# EAGLE design gateac11 (EAGLE 8.6.3)
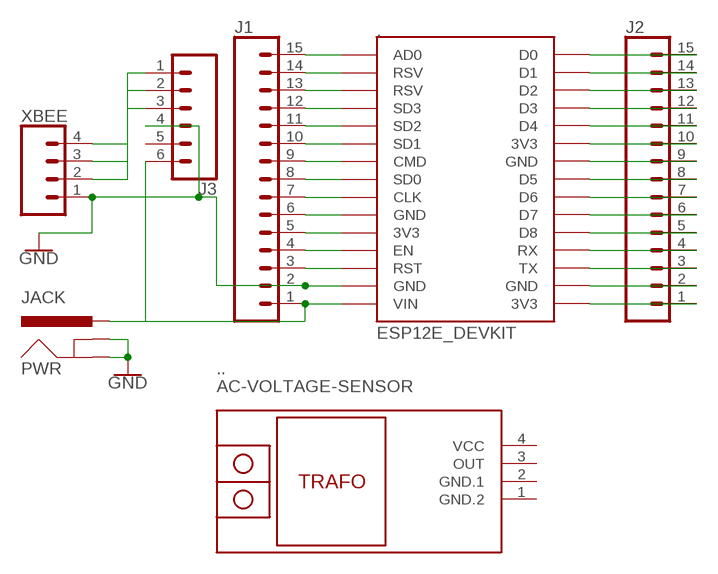
[diagram p0: schematic, sheet 1]

## Parts
.  ESP12E_DEVKIT  [ESP12E_DEVKIT]
..  AC-VOLTAGE-SENSOR  [AC-VOLTAGE-SENSOR]
J1  CONN_15  [1X15]
J2  CONN_15  [1X15]
J3  CONN_06SILK_FEMALE_PTH  [1X06]
PWR  JACK  POWER_JACKPTH_BREAD  [POWER_JACK_PTH_BREAD]
XBEE  CONN_04  [1X04]

## Nets
3V3: J3.1 XBEE.4
GND: ..GND@1(GND) J1.2 J3.4 PWR.GND PWR.GNDBREAK XBEE.1
N$1: ..AD0 J1.15
N$2: ..RSV@0(RSV) J1.14
N$3: ..RSV@1(RSV) J1.13
N$4: ..SD3 J1.12
N$5: ..SD2 J1.11
N$6: ..SD1 J1.10
N$7: ..CMD J1.9
N$8: ..SD0 J1.8
N$9: ..CLK J1.7
N$10: ..GND@0(GND) J1.6
N$11: ..3V3@0(3V3) J1.5
N$12: ..EN J1.4
N$13: ..RST J1.3
N$15: ..VIN J1.1 J3.6 PWR.PWR
N$16: ..D0 J2.15
N$17: ..D1 J2.14
N$18: ..D2 J2.13
N$19: ..D3 J2.12
N$20: ..D4 J2.11
N$21: ..3V3@1(3V3) J2.10
N$22: ..GND@2(GND) J2.9
N$23: ..D5 J2.8
N$24: ..D6 J2.7
N$25: ..D7 J2.6
N$26: ..D8 J2.5
N$27: ..RX J2.4
N$28: ..TX J2.3
N$29: ..GND@3(GND) J2.2
N$30: ..3V3@2(3V3) J2.1
RX: J3.3 XBEE.2
TX: J3.2 XBEE.3
Unconnected: ...3(OUT) J3.5

## Power pins joined to a net without a drawn wire
GND.1: ...2(GND.1)
GND.2: ...1(GND.2)
VCC: ...4(VCC)

## Library data of the parts
. = ESP12E_DEVKIT:ESP12E_DEVKIT: ESP12E DEVKIT BOARD
.. = diy-modules:AC-VOLTAGE-SENSOR: Isolated AC Voltage Sensor based on ZMPT101B transformer ZMPT101B Voltage Transformer Operating Guide is available here: http://www.zeming-e.com/file/0_2013_10_18_093344.pdf Click here to find device on ebay.com <http://www.ebay.com/sch/arduino+voltage+transformer>
J1 J2 = SparkFun-Connectors:CONN_15: Multi connection point. Often used as Generic Header-pin footprint for 0.1 inch spaced/style header connections On any of the 0.1 inch spaced packages, you can populate with these: Break Away Headers - Straight <https://www.sparkfun.com/products/116> (PRT-00116) Break Away Male Headers - Right Angle <https://www.sparkfun.com/products/553> (PRT-00553) Female Headers <https://www.sparkfun.com/products/115> (PRT-00115) Break Away Headers - Machine Pin <https://www.sparkfun.com/products/117> (PRT-00117) Break Away Female Headers - Swiss Machine Pin <https://www.sparkfun.com/products/743> (PRT-00743) For SCREWTERMINALS and SPRING TERMINALS visit here: Screw Terimnals on SparkFun.com <https://www.sparkfun.com/search/results?term=Screw+Terminals> (5mm/3.5mm/2.54mm spacing) This device is also useful as a general connection point to wire up your design to another part of your project. Our various solder wires solder well into these plated through hole pads. Hook-Up Wire - Assortment (Stranded, 22 AWG) <https://www.sparkfun.com/products/11375> (PRT-11375) Hook-Up Wire - Assortment (Solid Core, 22 AWG) <https://www.sparkfun.com/products/11367> (PRT-11367) View the entire wire category on our website here <https://www.sparkfun.com/categories/141> Special notes: Molex polarized connector foot print use with SKU : PRT-08231 with associated crimp pins and housings. 1MM SMD Version SKU: PRT-10208 NOTES ON THE VARIANTS LOCK and LOCK_LONGPADS... This footprint was designed to help hold the alignment of a through-hole component (i.e. 6-pin header) while soldering it into place. You may notice that each hole has been shifted either up or down by 0.005 of an inch from it's more standard position (which is a perfectly straight line). This slight alteration caused the pins (the squares in the middle) to touch the edges of the holes. Because they are alternating, it causes a "brace" to hold the component in place. 0.005 has proven to be the perfect amount of "off-center" position when using our standard breakaway headers. Although looks a little odd when you look at the bare footprint, once you have a header in there, the alteration is very hard to notice. Also,if you push a header all the way into place, it is covered up entirely on the bottom side.
J3 = SparkFun-Connectors:CONN_06: Multi connection point. Often used as Generic Header-pin footprint for 0.1 inch spaced/style header connections On any of the 0.1 inch spaced packages, you can populate with these: Break Away Headers - Straight <https://www.sparkfun.com/products/116> (PRT-00116) Break Away Male Headers - Right Angle <https://www.sparkfun.com/products/553> (PRT-00553) Female Headers <https://www.sparkfun.com/products/115> (PRT-00115) Break Away Headers - Machine Pin <https://www.sparkfun.com/products/117> (PRT-00117) Break Away Female Headers - Swiss Machine Pin <https://www.sparkfun.com/products/743> (PRT-00743) Arduino Stackable Header - 6 Pin <https://www.sparkfun.com/products/9280> (PRT-09280) For SCREWTERMINALS and SPRING TERMINALS visit here: Screw Terimnals on SparkFun.com <https://www.sparkfun.com/search/results?term=Screw+Terminals> (5mm/3.5mm/2.54mm spacing) This device is also useful as a general connection point to wire up your design to another part of your project. Our various solder wires solder well into these plated through hole pads. Hook-Up Wire - Assortment (Stranded, 22 AWG) <https://www.sparkfun.com/products/11375> (PRT-11375) Hook-Up Wire - Assortment (Solid Core, 22 AWG) <https://www.sparkfun.com/products/11367> (PRT-11367) View the entire wire category on our website here <https://www.sparkfun.com/categories/141>; PROD_ID: CONN-08437
PWR = SparkFun-Connectors:POWER_JACK: Power Jack Connector This is the standard 5.5mm barrel jack for power. The PTH is the most common, proven, reliable, footprint. The Slot footprint only works if the mill layer is transmitted to the PCB fab house so be warned. Here are the connectors we sell at SparkFun: DC Barrel Power Jack/Connector <https://www.sparkfun.com/products/119> (PRT-00119) DC Barrel Power Jack/Connector (SMD) <https://www.sparkfun.com/products/12748> (PRT-12748) DC Barrel Jack Adapter - Breadboard Compatible <https://www.sparkfun.com/products/10811> (PRT-10811) It is used on this SparkFun product (and many, many others): SparkFun RedBoard - Programmed with Arduino <https://www.sparkfun.com/products/12757> (DEV-12757) Also, if you need a mating power supply or connector, please check these out: Wall Adapter Power Supply - 9VDC 650mA <https://www.sparkfun.com/products/298> (TOL-00298) DC Barrel Jack Adapter - Male <https://www.sparkfun.com/products/10287> (PRT-10287); PROD_ID: PRT-10811
XBEE = SparkFun-Connectors:CONN_04: Multi connection point. Often used as Generic Header-pin footprint for 0.1 inch spaced/style header connections On any of the 0.1 inch spaced packages, you can populate with these: Break Away Headers - Straight <https://www.sparkfun.com/products/116> (PRT-00116) Break Away Male Headers - Right Angle <https://www.sparkfun.com/products/553> (PRT-00553) Female Headers <https://www.sparkfun.com/products/115> (PRT-00115) Break Away Headers - Machine Pin <https://www.sparkfun.com/products/117> (PRT-00117) Break Away Female Headers - Swiss Machine Pin <https://www.sparkfun.com/products/743> (PRT-00743) For SCREWTERMINALS and SPRING TERMINALS visit here: Screw Terimnals on SparkFun.com <https://www.sparkfun.com/search/results?term=Screw+Terminals> (5mm/3.5mm/2.54mm spacing) This device is also useful as a general connection point to wire up your design to another part of your project. Our various solder wires solder well into these plated through hole pads. Hook-Up Wire - Assortment (Stranded, 22 AWG) <https://www.sparkfun.com/products/11375> (PRT-11375) Hook-Up Wire - Assortment (Solid Core, 22 AWG) <https://www.sparkfun.com/products/11367> (PRT-11367) View the entire wire category on our website here <https://www.sparkfun.com/categories/141> Special notes: Molex polarized connector foot print use with SKU : PRT-08231 with associated crimp pins and housings. 1MM SMD Version SKU: PRT-10208; PROD_ID: CONN-09696

## Board
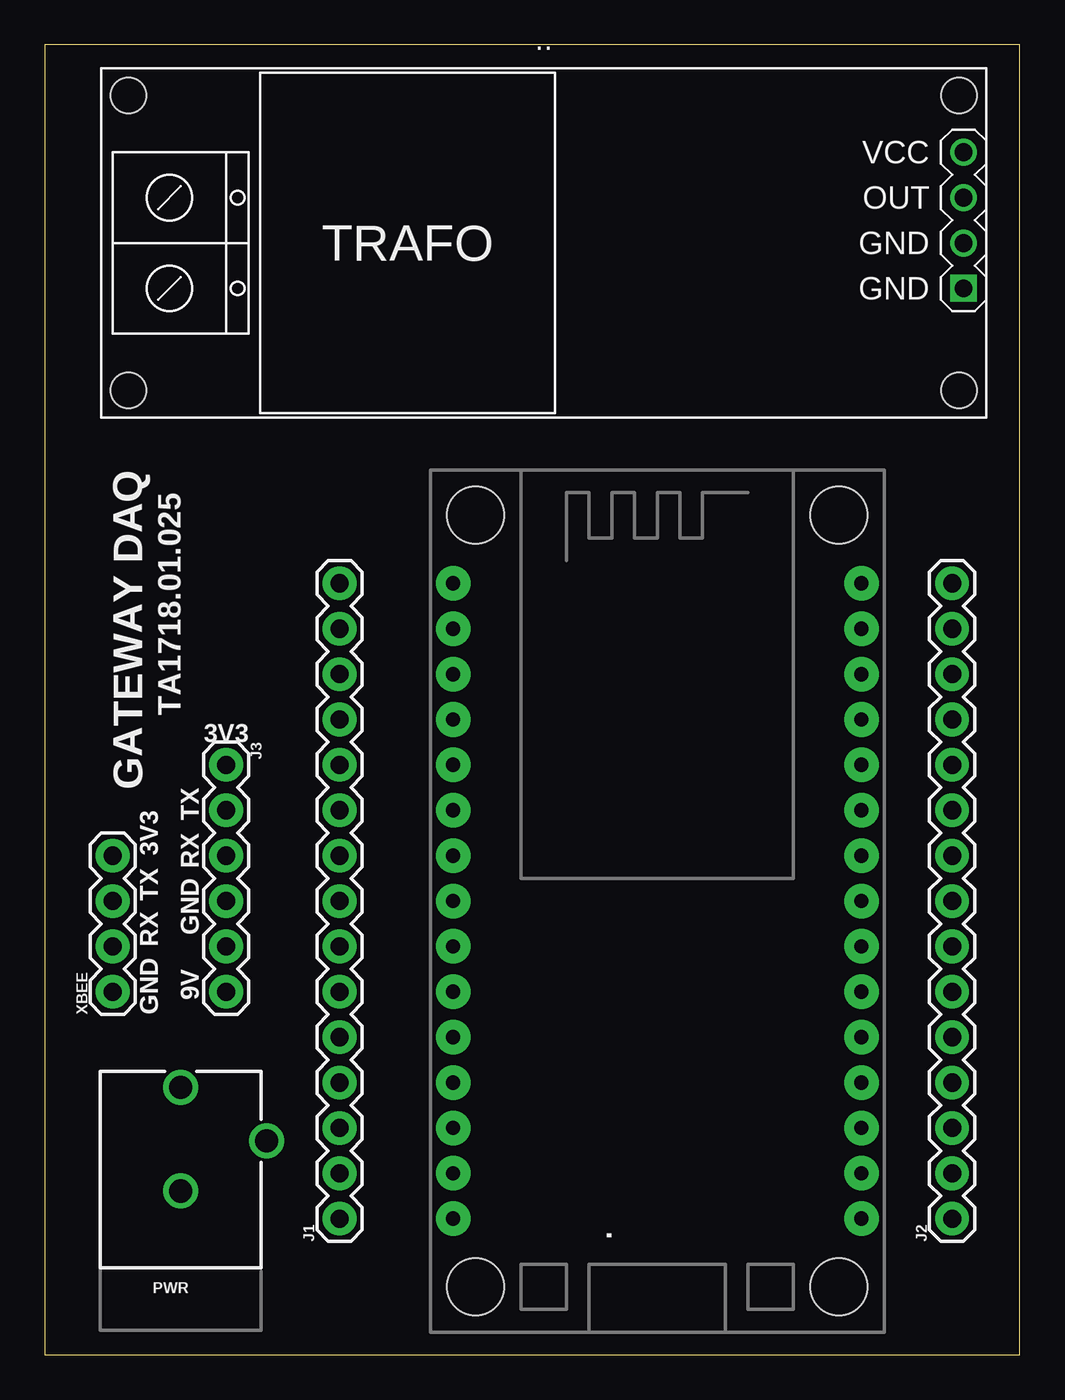
[diagram p1: board, top side]
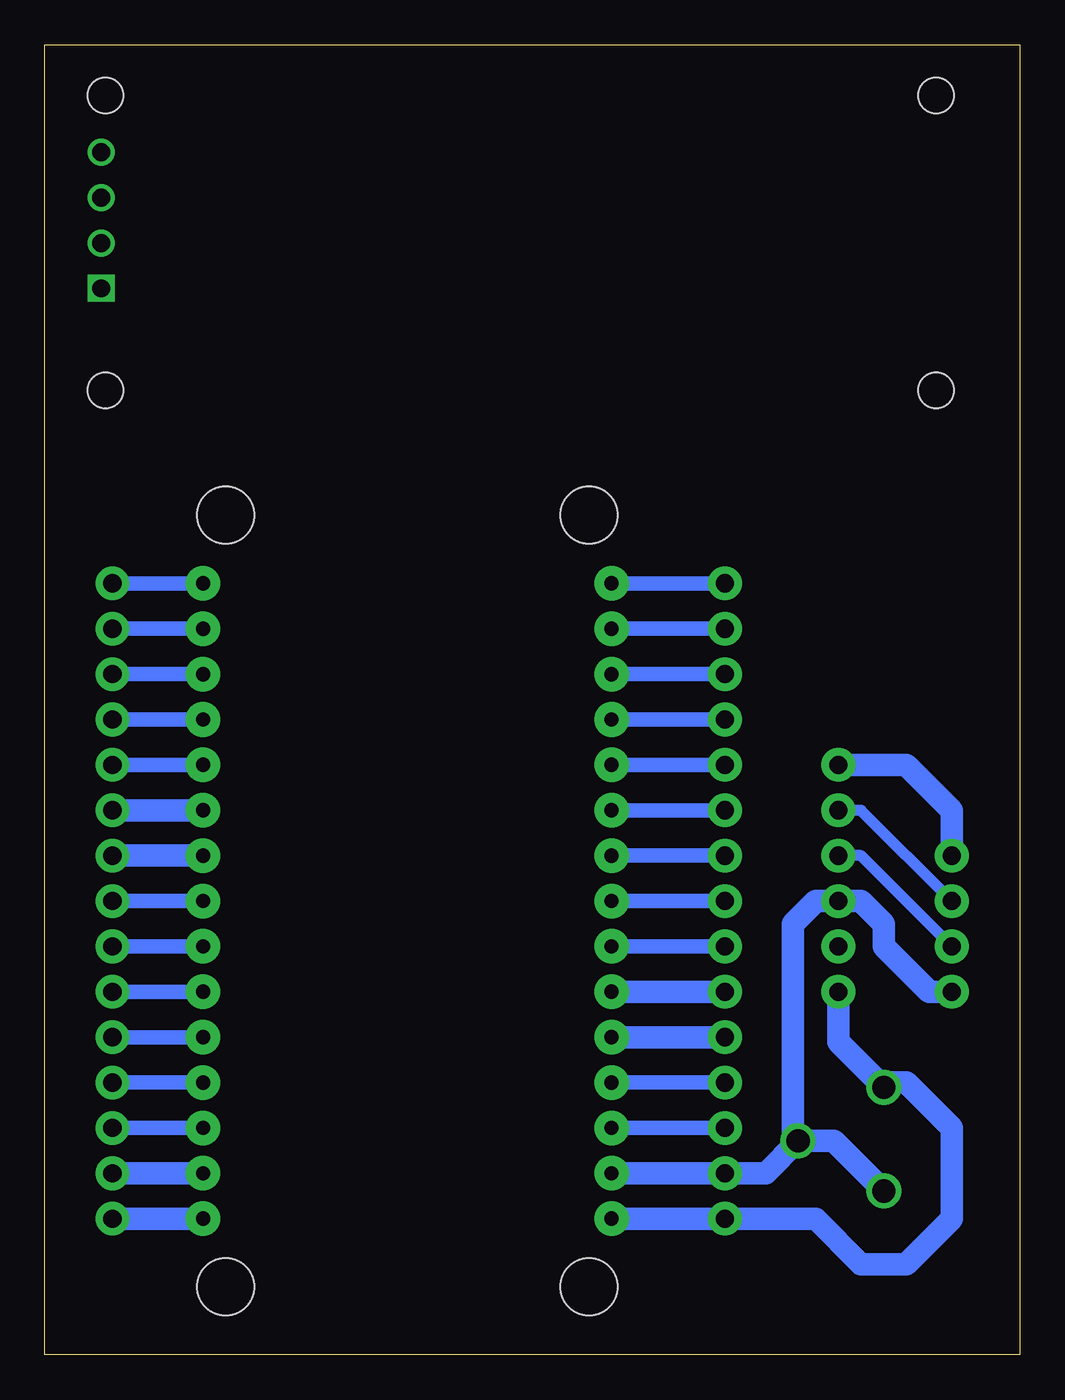
[diagram p2: board, bottom side, seen from below]

Size 54.59 x 73.33 mm. Coordinates in mm from the lower left corner, seen from the top.
Outline: 0,0 54.59,0 54.59,73.33 0,73.33 0,0
Copper layers (1*16): Top 0.035mm / dielectric 1.5mm / Bottom 0.035mm
Design rules "default": minimum track width 6mil, minimum drill 0.35mm, track to track 6mil, track to pad 6mil, pad to pad 6mil, via to via 6mil, smd to smd 6mil, copper to edge 40mil, drill to drill 6mil, minimum pad ring 10mil, minimum via ring 8mil, stop-mask expansion 4mil, vias tented up to drill 0mil, thermal gap 10mil

### Footprints (pad centres in the part's own frame; a part is rotated, then mirrored left to right if it is on the bottom)
ESP12E_DEVKIT = drill 0.8 pad 1.93: 3V3@0 -11.43,-7.62; 3V3@1 11.43,5.08; 3V3@2 11.43,-17.78; AD0 -11.43,17.78; CLK -11.43,-2.54; CMD -11.43,2.54; D0 11.43,17.78; D1 11.43,15.24; D2 11.43,12.7; D3 11.43,10.16; D4 11.43,7.62; D5 11.43,0; D6 11.43,-2.54; D7 11.43,-5.08; D8 11.43,-7.62; EN -11.43,-10.16; GND@0 -11.43,-5.08; GND@1 -11.43,-15.24; GND@2 11.43,2.54; GND@3 11.43,-15.24; RST -11.43,-12.7; RSV@0 -11.43,15.24; RSV@1 -11.43,12.7; RX 11.43,-10.16; SD0 -11.43,0; SD1 -11.43,5.08; SD2 -11.43,7.62; SD3 -11.43,10.16; TX 11.43,-12.7; VIN -11.43,-17.78 | hole 3.2: -10.16,21.59; 10.16,21.59; 10.16,-21.59; -10.16,-21.59
AC-VOLTAGE-SENSOR = drill 1 square: 1 23.495,-2.54 | drill 1: 2 23.495,0; 3 23.495,2.54; 4 23.495,5.08 | hole 2: -23.241,8.255; -23.241,-8.255; 23.241,-8.255; 23.241,8.255
1X15 = drill 1.016 pad 1.88: 1 0,0; 2 2.54,0; 3 5.08,0; 4 7.62,0; 5 10.16,0; 6 12.7,0; 7 15.24,0; 8 17.78,0; 9 20.32,0; 10 22.86,0; 11 25.4,0; 12 27.94,0; 13 30.48,0; 14 33.02,0; 15 35.56,0
1X06 = drill 1.016 pad 1.88: 1 0,0; 2 2.54,0; 3 5.08,0; 4 7.62,0; 5 10.16,0; 6 12.7,0
POWER_JACK_PTH_BREAD = drill 1.3: GND 0,7.9; GNDBREAK 4.8,10.7; PWR 0,13.7
1X04 = drill 1.016 pad 1.88: 1 0,0; 2 2.54,0; 3 5.08,0; 4 7.62,0

### Placement (x,y rotation side)
.  34.29,25.4 0 top
..  27.94,62.23 0 top
J1  16.51,7.62 90 top
J2  50.8,7.62 90 top
J3  10.16,33.02 270 top
PWR  7.62,1.27 0 top
XBEE  3.81,20.32 90 top

### Tracks (layer width: path | path; a pad name or v marks a point on that pad's centre or on a via)
3V3
  Bottom 1.27: XBEE.4 3.81,30.48 6.35,33.02 J3.1
GND
  Bottom 1.27: PWR.GNDBREAK 14.23,10.16 J1.2 ..GND@1 | PWR.GND 10.42,11.97 PWR.GNDBREAK | PWR.GNDBREAK 12.7,12.25 12.7,24.13 11.43,25.4 J3.4 8.89,25.4 7.62,24.13 7.62,22.86 5.08,20.32 XBEE.1
N$1
  Bottom 0.813: J1.15 ..AD0
N$2
  Bottom 0.813: J1.14 ..RSV@0
N$3
  Bottom 0.813: J1.13 ..RSV@1
N$4
  Bottom 0.813: J1.12 ..SD3
N$5
  Bottom 0.813: J1.11 ..SD2
N$6
  Bottom 0.813: J1.10 ..SD1
N$7
  Bottom 0.813: J1.9 ..CMD
N$8
  Bottom 0.813: J1.8 ..SD0
N$9
  Bottom 0.813: J1.7 ..CLK
N$10
  Bottom 1.27: J1.6 ..GND@0
N$11
  Bottom 1.27: J1.5 ..3V3@0
N$12
  Bottom 0.813: J1.4 ..EN
N$13
  Bottom 0.813: J1.3 ..RST
N$15
  Bottom 1.27: ..VIN J1.1 11.43,7.62 8.89,5.08 6.35,5.08 3.81,7.62 3.81,12.7 6.35,15.24 7.35,15.24 PWR.PWR 10.16,17.51 J3.6
N$16
  Bottom 0.813: ..D0 J2.15
N$17
  Bottom 0.813: ..D1 J2.14
N$18
  Bottom 0.813: ..D2 J2.13
N$19
  Bottom 0.813: ..D3 J2.12
N$20
  Bottom 0.813: ..D4 J2.11
N$21
  Bottom 1.27: ..3V3@1 J2.10
N$22
  Bottom 1.27: ..GND@2 J2.9
N$23
  Bottom 0.813: ..D5 J2.8
N$24
  Bottom 0.813: ..D6 J2.7
N$25
  Bottom 0.813: ..D7 J2.6
N$26
  Bottom 0.813: ..D8 J2.5
N$27
  Bottom 0.813: ..RX J2.4
N$28
  Bottom 0.813: ..TX J2.3
N$29
  Bottom 1.27: ..GND@3 J2.2
N$30
  Bottom 1.27: ..3V3@2 J2.1
RX
  Bottom 0.61: XBEE.2 8.89,27.94 J3.3
TX
  Bottom 0.61: XBEE.3 8.89,30.48 J3.2

### Text on the board
tNames: GATEWAY DAQ | TA1718.01.025 | 3V3 | TX | RX | 3V3 | GND | TX | RX | 9V | GND